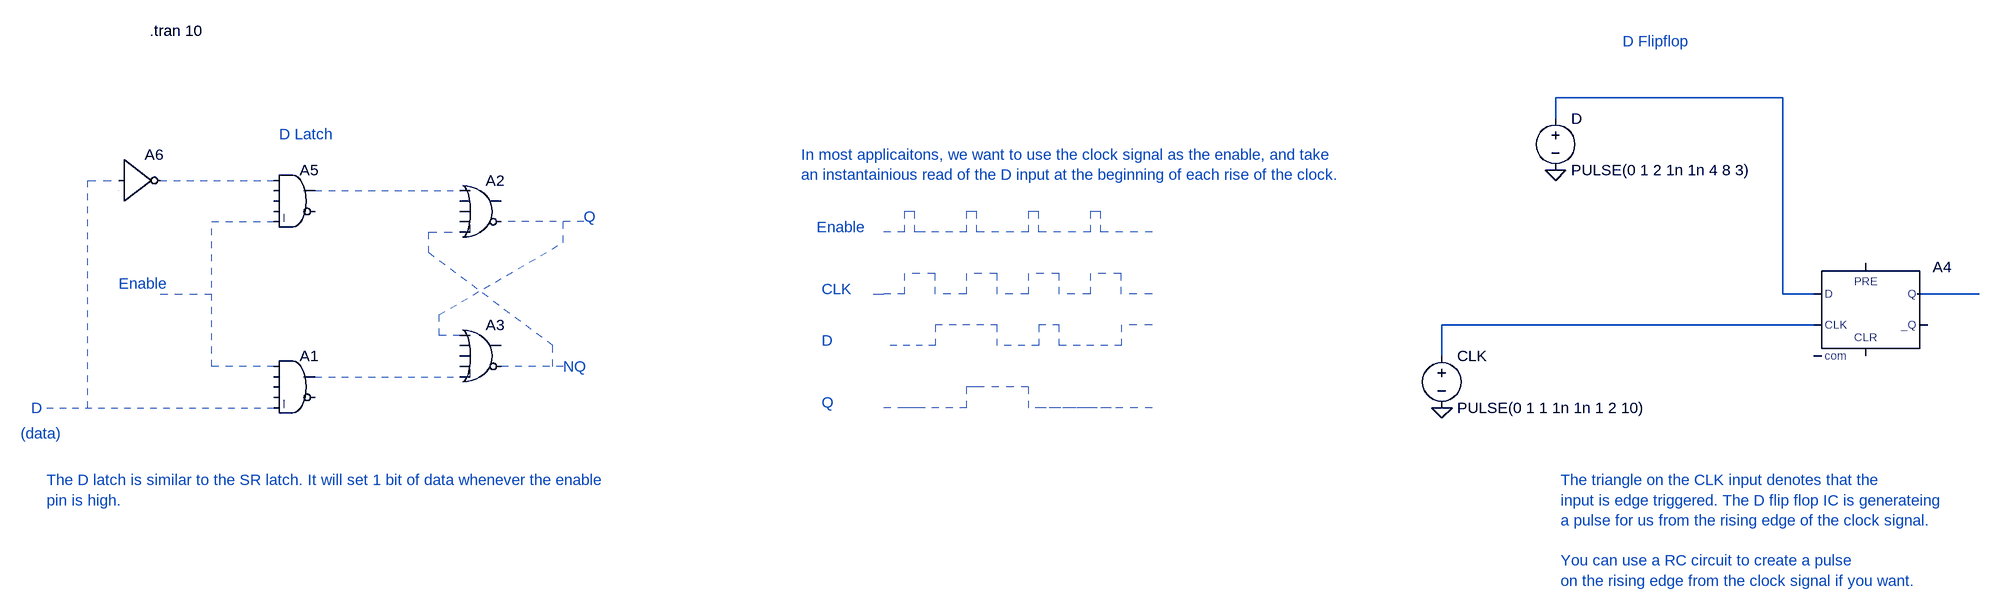
[diagram p0: schematic D Flipflop.asc]
D Flipflop.asc, the LTspice schematic file:
Version 4
SHEET 1 3556 1652
WIRE 2416 384 2064 384
WIRE 2064 416 2064 384
WIRE 2416 688 2416 384
WIRE 2464 688 2416 688
WIRE 2720 688 2624 688
WIRE 2464 736 1888 736
WIRE 1888 784 1888 736
FLAG 1888 864 0
FLAG 2064 496 0
SYMBOL Digital\\or 400 496 R0
SYMATTR InstName A2
SYMBOL Digital\\or 400 720 R0
SYMATTR InstName A3
SYMBOL Digital\\and 112 768 R0
SYMATTR InstName A1
SYMBOL Digital\\and 112 480 R0
SYMATTR InstName A5
SYMBOL Digital\\inv -160 448 R0
SYMATTR InstName A6
SYMBOL Digital\\dflop 2544 640 R0
SYMATTR InstName A4
SYMBOL voltage 1888 768 R0
WINDOW 123 0 0 Left 0
WINDOW 39 0 0 Left 0
SYMATTR InstName CLK
SYMATTR Value PULSE(0 1 1 1n 1n 1 2 10)
SYMBOL voltage 2064 400 R0
WINDOW 123 0 0 Left 0
WINDOW 39 0 0 Left 0
SYMATTR InstName D
SYMATTR Value PULSE(0 1 2 1n 1n 4 8 3)
TEXT -112 280 Left 2 !.tran 10
TEXT 560 568 Left 2 ;Q
TEXT 528 800 Left 2 ;NQ
TEXT -296 864 Left 2 ;D
TEXT -160 672 Left 2 ;Enable
TEXT 88 440 Left 2 ;D Latch
TEXT -312 904 Left 2 ;(data)
TEXT -272 976 Left 2 ;The D latch is similar to the SR latch. It will set 1 bit of data whenever the enable\npin is high.
TEXT 896 472 Left 2 ;In most applicaitons, we want to use the clock signal as the enable, and take\nan instantainious read of the D input at the beginning of each rise of the clock.
TEXT 920 584 Left 2 ;Enable
TEXT 928 680 Left 2 ;CLK
TEXT 928 760 Left 2 ;D
TEXT 928 856 Left 2 ;Q
TEXT 2072 976 Left 2 ;The triangle on the CLK input denotes that the\ninput is edge triggered. The D flip flop IC is generateing\na pulse for us from the rising edge of the clock signal.\n \nYou can use a RC circuit to create a pulse\non the rising edge from the clock signal if you want.
TEXT 2168 296 Left 2 ;D Flipflop
LINE Normal 288 528 368 528 2
LINE Normal 560 576 432 576 2
LINE Normal 320 592 368 592 2
LINE Normal 320 624 320 592 2
LINE Normal 512 768 320 624 2
LINE Normal 512 800 512 768 2
LINE Normal 528 800 432 800 2
LINE Normal 528 608 528 576 2
LINE Normal 336 720 528 608 2
LINE Normal 336 752 336 720 2
LINE Normal 368 752 336 752 2
LINE Normal 288 816 368 816 2
LINE Normal 144 816 288 816 2
LINE Normal 144 528 288 528 2
LINE Normal -16 576 80 576 2
LINE Normal -16 800 -16 576 2
LINE Normal 80 800 -16 800 2
LINE Normal -96 688 -16 688 2
LINE Normal -96 512 80 512 2
LINE Normal -272 864 80 864 2
LINE Normal -208 512 -160 512 2
LINE Normal -208 864 -208 512 2
LINE Normal 1056 688 1024 688 2
LINE Normal 1056 656 1056 688 2
LINE Normal 1104 656 1056 656 2
LINE Normal 1104 688 1104 656 2
LINE Normal 1104 768 1024 768 2
LINE Normal 1104 736 1104 768 2
LINE Normal 1200 736 1104 736 2
LINE Normal 1200 768 1200 736 2
LINE Normal 1264 768 1200 768 2
LINE Normal 1264 736 1264 768 2
LINE Normal 1296 736 1264 736 2
LINE Normal 1296 768 1296 736 2
LINE Normal 1392 768 1296 768 2
LINE Normal 1392 736 1392 768 2
LINE Normal 1056 592 1024 592 2
LINE Normal 1056 560 1056 592 2
LINE Normal 1072 560 1056 560 2
LINE Normal 1072 592 1072 560 2
LINE Normal 1088 592 1072 592 2
LINE Normal 1152 688 1104 688 2
LINE Normal 1008 688 1024 688 2
LINE Normal 1152 656 1152 688 2
LINE Normal 1200 656 1152 656 2
LINE Normal 1200 688 1200 656 2
LINE Normal 1248 688 1200 688 2
LINE Normal 1248 656 1248 688 2
LINE Normal 1296 656 1248 656 2
LINE Normal 1296 688 1296 656 2
LINE Normal 1344 688 1296 688 2
LINE Normal 1344 656 1344 688 2
LINE Normal 1392 656 1344 656 2
LINE Normal 1392 688 1392 656 2
LINE Normal 1440 688 1392 688 2
LINE Normal 1440 736 1392 736 2
LINE Normal 1152 592 1088 592 2
LINE Normal 1152 560 1152 592 2
LINE Normal 1168 560 1152 560 2
LINE Normal 1168 592 1168 560 2
LINE Normal 1248 592 1168 592 2
LINE Normal 1248 560 1248 592 2
LINE Normal 1264 560 1248 560 2
LINE Normal 1264 592 1264 560 2
LINE Normal 1344 592 1264 592 2
LINE Normal 1344 560 1344 592 2
LINE Normal 1360 560 1344 560 2
LINE Normal 1360 592 1360 560 2
LINE Normal 1440 592 1360 592 2
LINE Normal 1056 864 1024 864 2
LINE Normal 1088 864 1072 864 2
LINE Normal 1152 864 1088 864 2
LINE Normal 1152 832 1152 864 2
LINE Normal 1168 832 1152 832 2
LINE Normal 1344 864 1264 864 2
LINE Normal 1440 864 1360 864 2
LINE Normal 1248 832 1248 864 2
LINE Normal 1376 864 1248 864 2
LINE Normal 1248 832 1168 832 2
LINE Normal 1072 864 1056 864 2

The netlist it stands for:
* D Flipflop.asc
A2 0 0 0 0 0 0 0 0 OR
A3 0 0 0 0 0 0 0 0 OR
A1 0 0 0 0 0 0 0 0 AND
A5 0 0 0 0 0 0 0 0 AND
A6 0 0 0 0 0 0 0 0 BUF
A4 N001 0 N003 0 0 0 N002 0 DFLOP
V§CLK N003 0 PULSE(0 1 1 1n 1n 1 2 10)
V§D N001 0 PULSE(0 1 2 1n 1n 4 8 3)
.tran 10
* Q
* NQ
* D
* Enable
* D Latch
* (data)
* The D latch is similar to the SR latch. It will set 1 bit of data whenever the enable
* pin is high.
* In most applicaitons, we want to use the clock signal as the enable, and take
* an instantainious read of the D input at the beginning of each rise of the clock.
* Enable
* CLK
* D
* Q
* The triangle on the CLK input denotes that the
* input is edge triggered. The D flip flop IC is generateing
* a pulse for us from the rising edge of the clock signal.
* You can use a RC circuit to create a pulse
* on the rising edge from the clock signal if you want.
* D Flipflop
.backanno
.end